# EAGLE design kalib103_v2b (EAGLE 6.4)
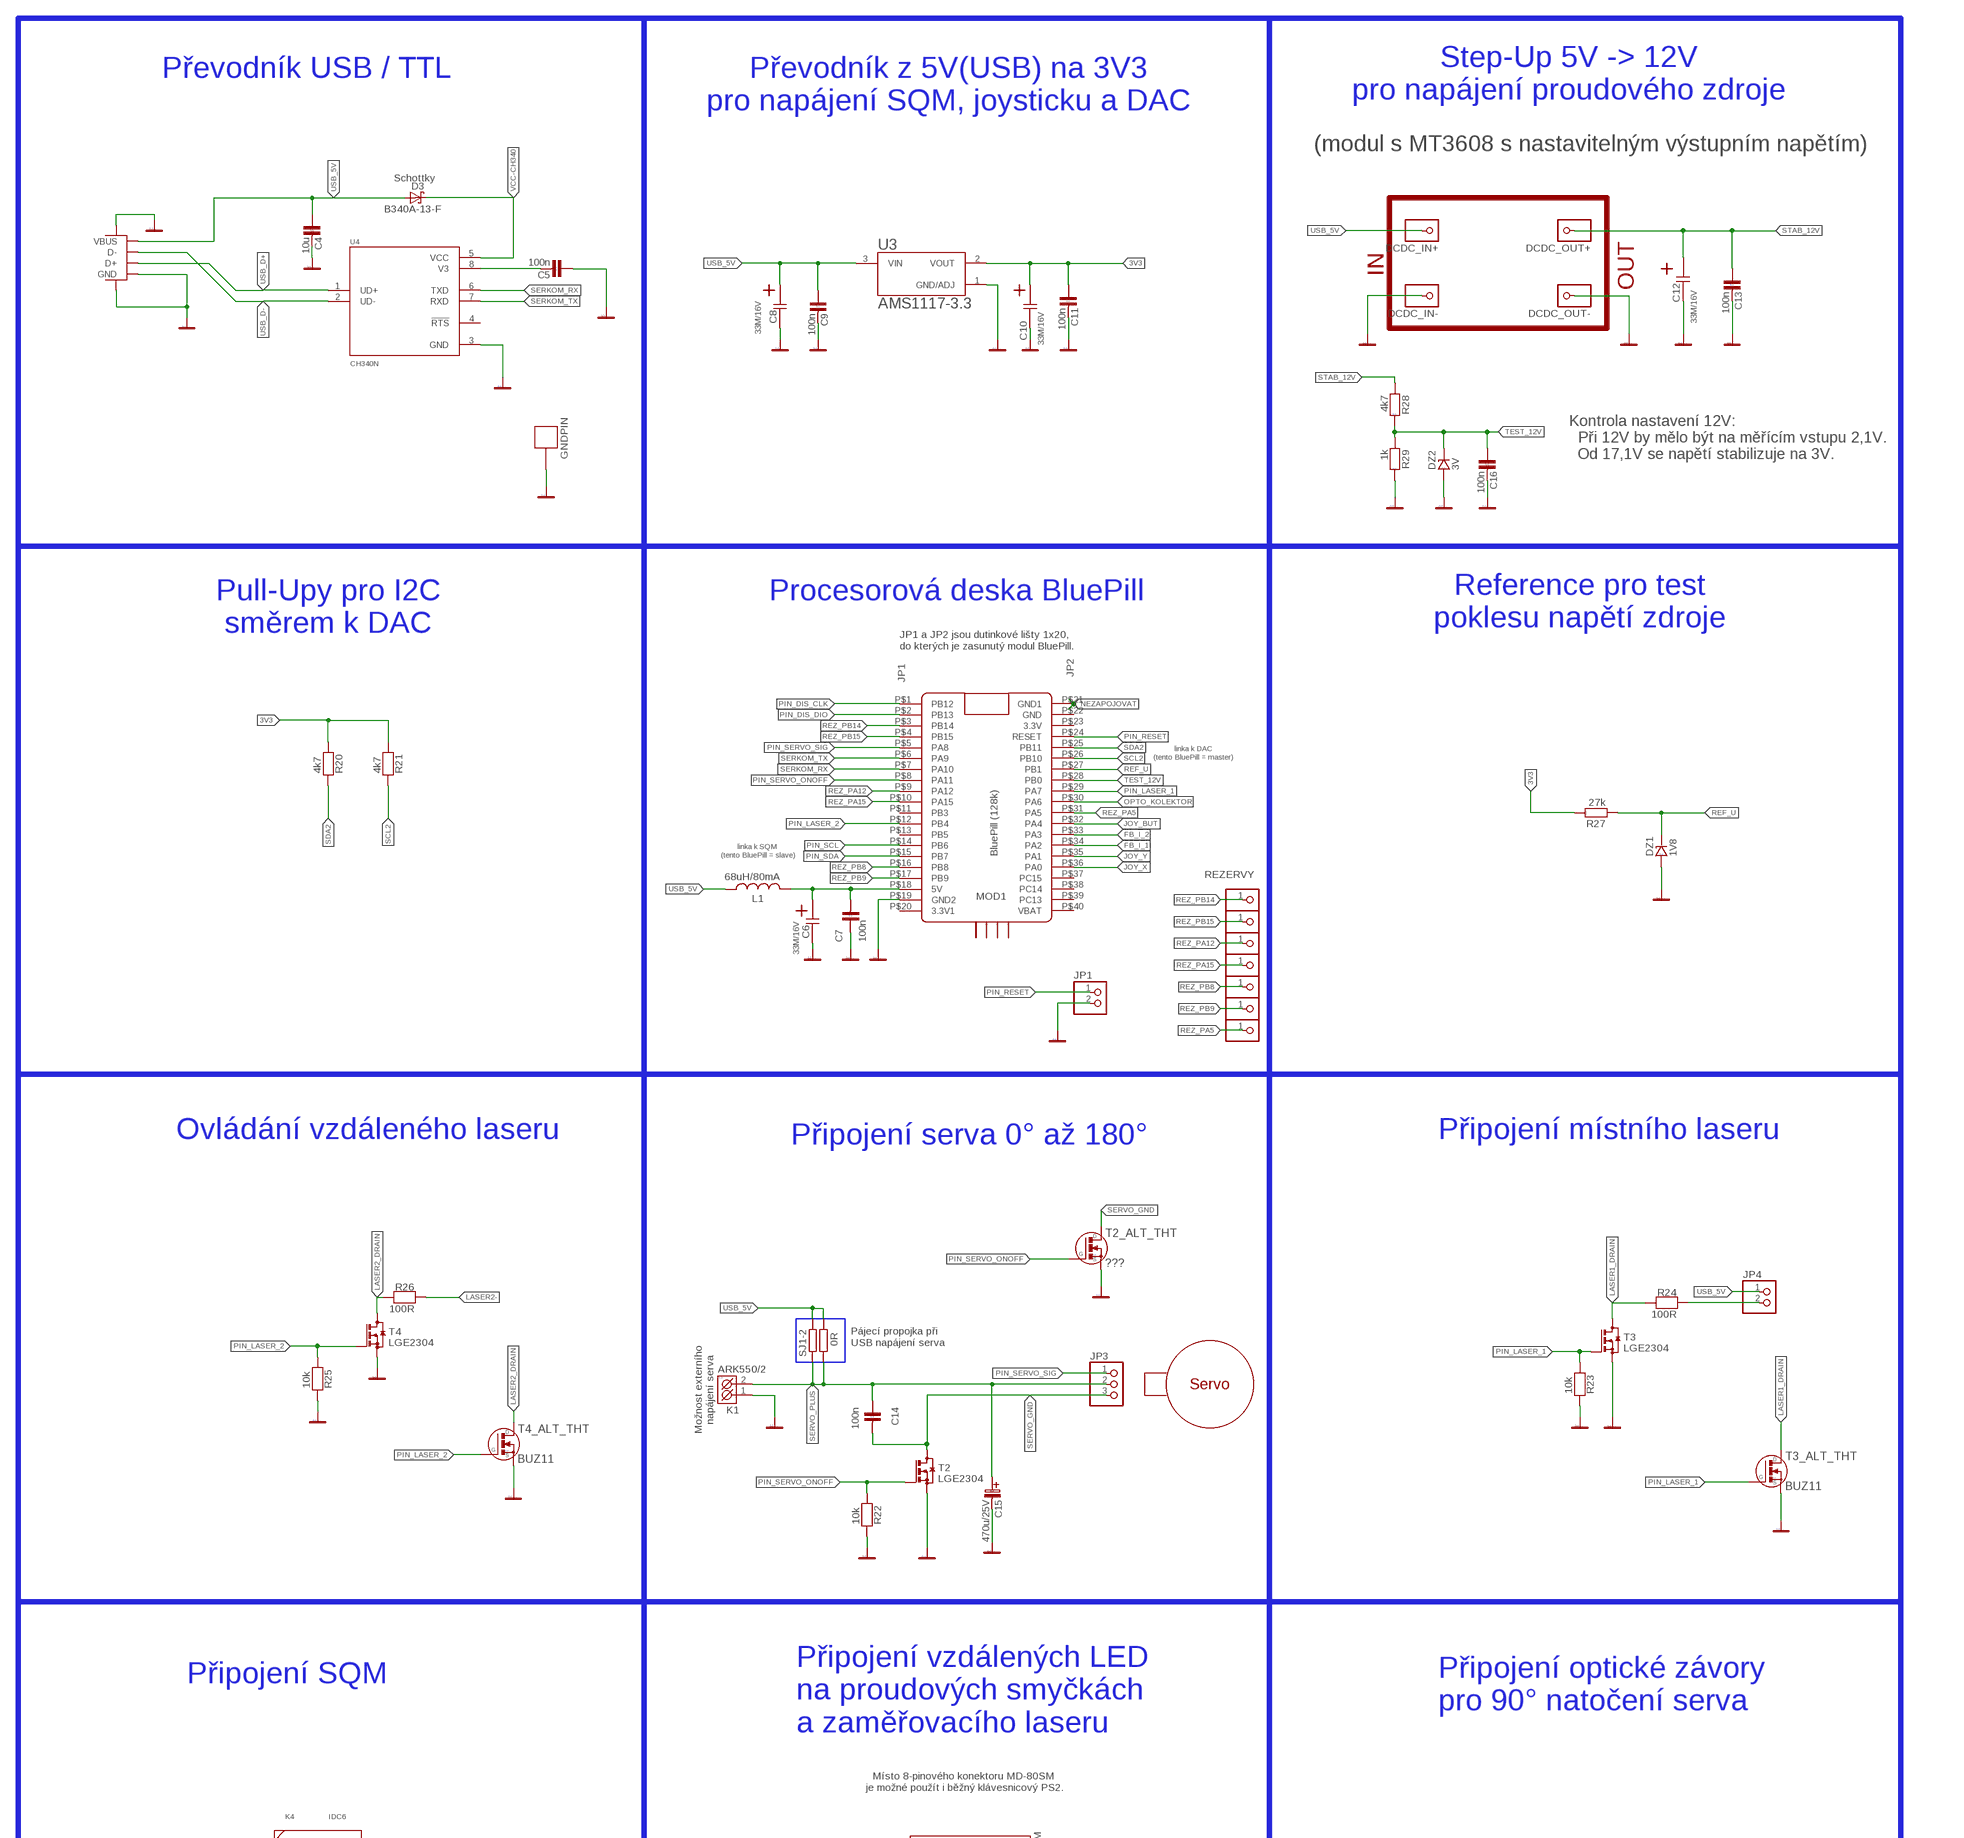
[diagram p0: schematic, sheet 1, part 1 of 2]
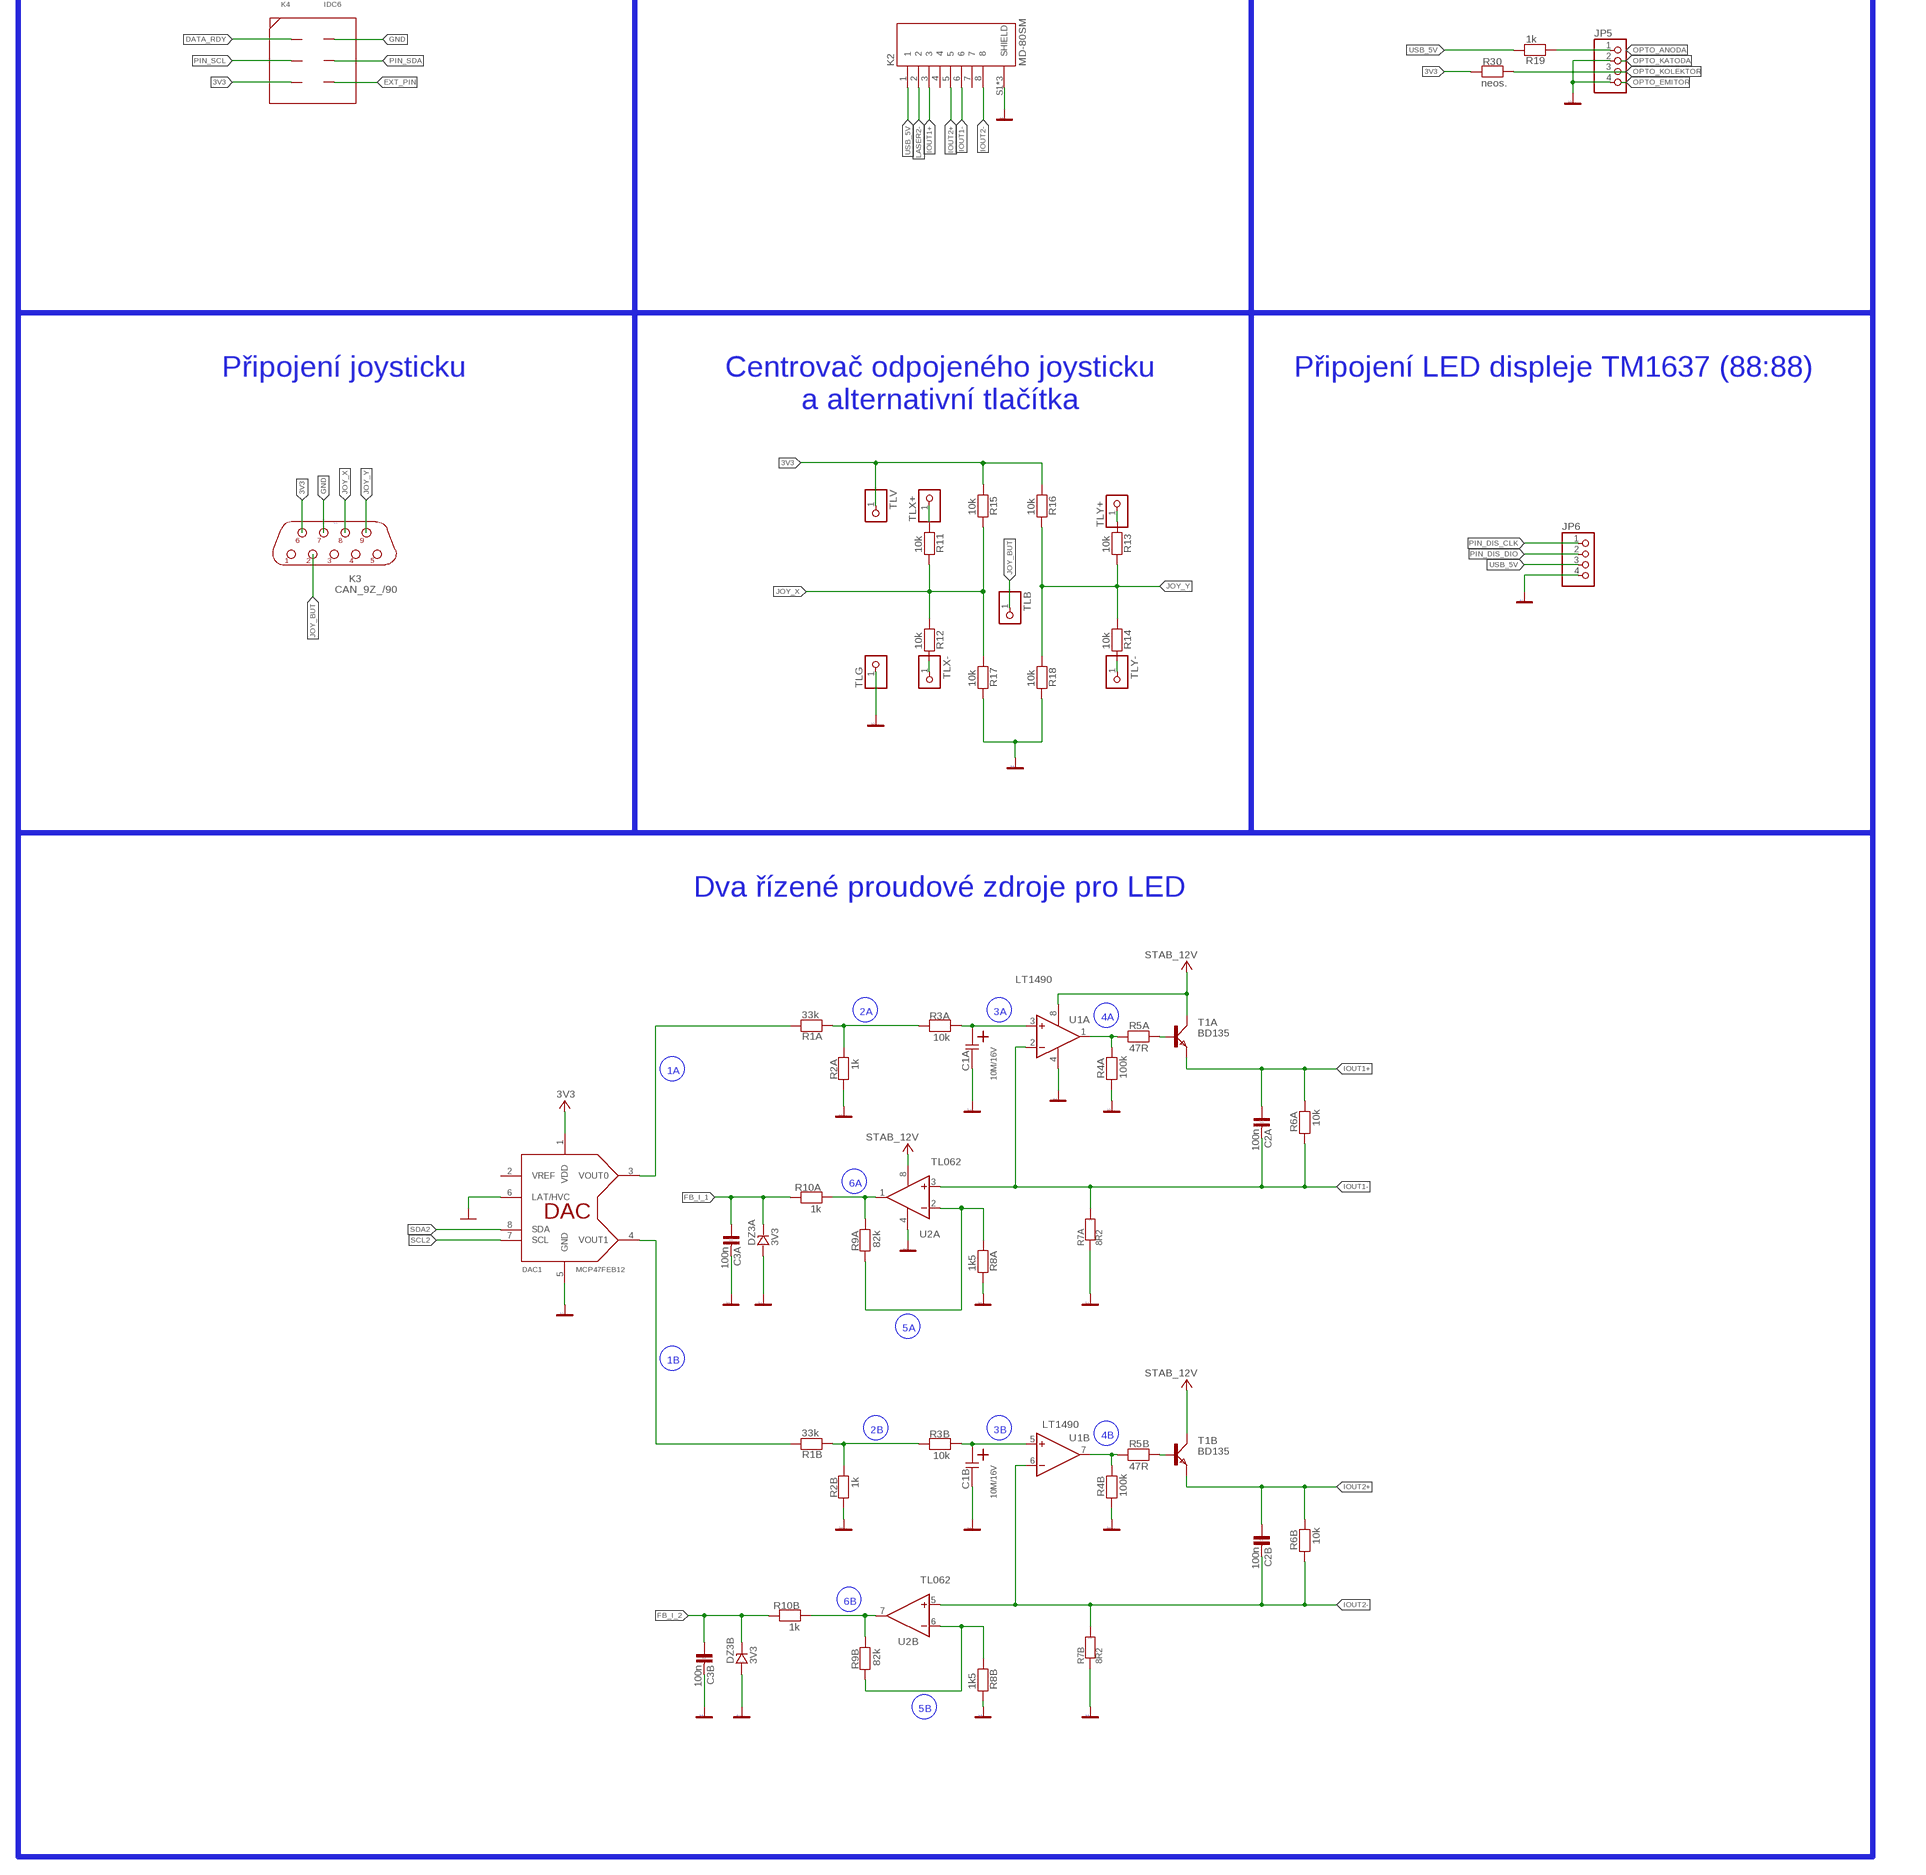
[diagram p1: schematic, sheet 1, part 2 of 2]

## Parts
C1A  10M/16V  C0805@2  [6032]
C1B  10M/16V  C0805@2  [6032]
C2A  100n  C-KERAMIK_SMD_0805  [0805]
C2B  100n  C-KERAMIK_SMD_0805  [0805]
C3A  100n  C-KERAMIK_SMD_0805  [0805]
C3B  100n  C-KERAMIK_SMD_0805  [0805]
C4  10u  C-KERAMIK_SMD_0805  [0805]
C5  100n  C-KERAMIK_SMD_0805  [0805]
C6  33M/16V  C0805@2  [6032]
C7  100n  C-KERAMIK_SMD_0805  [0805]
C8  33M/16V  C0805@2  [6032]
C9  100n  C-KERAMIK_SMD_0805  [0805]
C10  33M/16V  C0805@2  [6032]
C11  100n  C-KERAMIK_SMD_0805  [0805]
C12  33M/16V  C0805@2  [6032]
C13  100n  C-KERAMIK_SMD_0805  [0805]
C14  100n  C-KERAMIK_SMD_0805  [0805]
C15  470u/25V  C-EL_5  [C-EL_5]
C16  100n  C-KERAMIK_SMD_0805  [0805]
D3  B340A-13-F  SCHOTTKY-DIODESMD  [SMB]
DAC1  MCP47FEB12  MCP47FEB  [TSSOP-8]
DCDC_IN+  pin  PINHD-1X1-BIGPOGO  [1X1-BIGPOGO]
DCDC_IN-  pin  PINHD-1X1-BIGPOGO  [1X1-BIGPOGO]
DCDC_OUT+  pin  PINHD-1X1-BIGPOGO  [1X1-BIGPOGO]
DCDC_OUT-  pin  PINHD-1X1-BIGPOGO  [1X1-BIGPOGO]
DZ1  1V8  D-ZENEROVA_0,5W_BZV55C_SMD  [SOD-80]
DZ2  3V  D-ZENEROVA_0,5W_BZV55C_SMD  [SOD-80]
DZ3A  3V3  D-BZV55C_SMD_0,5W-ZENER  [SOD-80]
DZ3B  3V3  D-BZV55C_SMD_0,5W-ZENER  [SOD-80]
GNDPIN  BIGPIN  [BIGPIN]
JP1  PINHD-1X2  [1X02]
JP3  PINHD-1X3  [1X03]
JP4  PINHD-1X2  [1X02]
JP5  PINHD-1X4  [1X04]
JP6  PINHD-1X4  [1X04]
K1  ARK550/2  [ARK550/2]
K2  MD-80SM  [CUI_MD-80SM]
K3  CAN_9Z_/90  [CAN9Z/90]
K4  IDC6  [IDC6]
K5  USBPTH  [USB-B-PTH]
L1  68uH/80mA  L-USL0805  [L0805]
MOD1  BluePill (128k)  BLUE_PILL  [BLUE_PILL]
R1A  33k  R0805  [0805]
R1B  33k  R0805  [0805]
R2A  1k  R0805  [0805]
R2B  1k  R0805  [0805]
R3A  10k  R0805  [0805]
R3B  10k  R0805  [0805]
R4A  100k  R0805  [0805]
R4B  100k  R0805  [0805]
R5A  47R  R0805  [0805]
R5B  47R  R0805  [0805]
R6A  10k  R0805  [0805]
R6B  10k  R0805  [0805]
R7A  8R2  R_12,7  [R-12,7]
R7B  8R2  R_12,7  [R-12,7]
R8A  1k5  R0805  [0805]
R8B  1k5  R0805  [0805]
R9A  82k  R0805  [0805]
R9B  82k  R0805  [0805]
R10A  1k  R0805  [0805]
R10B  1k  R0805  [0805]
R11  10k  R0805  [0805]
R12  10k  R0805  [0805]
R13  10k  R0805  [0805]
R14  10k  R0805  [0805]
R15  10k  R0805  [0805]
R16  10k  R0805  [0805]
R17  10k  R0805  [0805]
R18  10k  R0805  [0805]
R19  1k  R0805  [0805]
R20  4k7  R0805  [0805]
R21  4k7  R0805  [0805]
R22  10k  R0805  [0805]
R23  10k  R0805  [0805]
R24  100R  R0805  [0805]
R25  10k  R0805  [0805]
R26  100R  R0805  [0805]
R27  27k  R_SMD_0805  [0805]
R28  4k7  R_SMD_0805  [0805]
R29  1k  R_SMD_0805  [0805]
R30  neos.  R0805  [0805]
REZERVA1  PINHD-1X1  [1X01]
REZERVA2  PINHD-1X1  [1X01]
REZERVA3  PINHD-1X1  [1X01]
REZERVA4  PINHD-1X1  [1X01]
REZERVA5  PINHD-1X1  [1X01]
REZERVA6  PINHD-1X1  [1X01]
REZERVA7  PINHD-1X1  [1X01]
SJ1-1  0R  R-EU_R0603  [R0603]
SJ1-2  0R  R-EU_R0603  [R0603]
T1A  BD135  BD139  [TO126AS]
T1B  BD135  BD139  [TO126AS]
T2  LGE2304  BSS123  [SOT23]
T2_ALT_THT  ???  BUZ11  [TO-220S]
T3  LGE2304  BSS123  [SOT23]
T3_ALT_THT  BUZ11  [TO-220S]
T4  LGE2304  BSS123  [SOT23]
T4_ALT_THT  BUZ11  [TO-220S]
TLB  PINHD-1X1  [1X01]
TLG  PINHD-1X1  [1X01]
TLV  PINHD-1X1  [1X01]
TLX+  PINHD-1X1  [1X01]
TLX-  PINHD-1X1  [1X01]
TLY+  PINHD-1X1  [1X01]
TLY-  PINHD-1X1  [1X01]
U1  LT1490  OP200P@2  [SOP-8]
U2  TL062  OP200P@2  [SOP-8]
U3  AMS1117-3.3  [SOT229P700X180-4N]
U4  CH340N  [SOIC127P600X160-8N]
U$1  SERVO_MG_996  [SERVO_MG_996]

## Nets
3V3: C10.1 C11.1 DAC1.1(VDD) K3.6 K4.P5(PIN5) R15.2 R16.2 R20.2 R21.2 R27.2 R30.2 TLV.1 U3.2(VOUT)
B_T1_A: R5A.2 T1A.B
B_T1_B: R5B.2 T1B.B
BOD_TLX+: R11.2 TLX+.1
BOD_TLX-: R12.1 TLX-.1
BOD_TLY+: R13.2 TLY+.1
BOD_TLY-: R14.1 TLY-.1
CH340-V3: C5.2 U4.8(V3)
DAC_OUT_0: DAC1.3(VOUT0) R1A.1
DAC_OUT_1: DAC1.4(VOUT1) R1B.1
DATA_RDY: K4.P1(PIN1)
EXT_PIN: K4.P6(PIN6)
FB_I_1: C3A.1 DZ3A.K MOD1.P$34(PA2) R10A.2
FB_I_2: C3B.1 DZ3B.K MOD1.P$33(PA3) R10B.2
GND: C1A.2 C1B.2 C3A.2 C3B.2 C4.2 C5.1 C6.2 C7.1 C8.2 C9.2 C10.2 C11.2 C12.2 C13.2 C15.C-(C_EL-) C16.2 DAC1.5(GND) DAC1.6(LAT/HVC) DCDC_IN-.P$1 DCDC_OUT-.P$1 DZ1.A DZ2.A DZ3A.A DZ3B.A GNDPIN.P$1 JP1.2 JP5.2 JP5.4 JP6.4 K1.1(K1) K2.S1(SHIELD) K2.S2(SHIELD) K2.S3(SHIELD) K3.7 K4.P2(PIN2) K5.GND K5.P$2(SHIELD) K5.SHIELD(SHIELD2) MOD1.P$19(GND2) R2A.2 R2B.2 R4A.2 R4B.2 R7A.1 R7B.1 R8A.1 R8B.1 R17.1 R18.1 R22.1 R23.1 R25.1 R29.2 T2.2(S) T2_ALT_THT.3(S) T3.2(S) T3_ALT_THT.3(S) T4.2(S) T4_ALT_THT.3(S) TLG.1 U1.4(P:V-) U2.4(P:V-) U3.1(GND/ADJ) U4.3(GND)
IN_DELIC_A: R1A.2 R2A.1 R3A.2
IN_DELIC_B: R1B.2 R2B.1 R3B.2
IOUT1+: C2A.1 K2.3 R6A.1 T1A.E
IOUT1-: C2A.2 K2.6 R6A.2 R7A.2 U1.2(A:-IN) U2.3(A:+IN)
IOUT2+: C2B.1 K2.5 R6B.1 T1B.E
IOUT2-: C2B.2 K2.8 R6B.2 R7B.2 U1.6(B:-IN) U2.5(B:+IN)
JOY_BUT: K3.2 MOD1.P$32(PA4) TLB.1
JOY_X: K3.8 MOD1.P$36(PA0) R11.1 R12.2 R15.1 R17.2
JOY_Y: K3.9 MOD1.P$35(PA1) R13.1 R14.2 R16.1 R18.2
LASER1-: JP4.2 R24.1
LASER1_DRAIN: R24.2 T3.3(D) T3_ALT_THT.2(D)
LASER2-: K2.2 R26.1
LASER2_DRAIN: R26.2 T4.3(D) T4_ALT_THT.2(D)
NEZAPOJOVAT: MOD1.P$21(GND1)
OPTO_ANODA: JP5.1 R19.2
OPTO_KOLEKTOR: JP5.3 MOD1.P$30(PA6) R30.1
OUT_I1_FB: R9A.1 R10A.1 U2.1(A:OUT)
OUT_I2_FB: R9B.1 R10B.1 U2.7(B:OUT)
OUT_U1A: R4A.1 R5A.1 U1.1(A:OUT)
OUT_U1B: R4B.1 R5B.1 U1.7(B:OUT)
PIN_DIS_CLK: JP6.1 MOD1.P$1(PB12)
PIN_DIS_DIO: JP6.2 MOD1.P$2(PB13)
PIN_LASER_1: MOD1.P$29(PA7) R23.2 T3.1(G) T3_ALT_THT.1(G)
PIN_LASER_2: MOD1.P$12(PB4) R25.2 T4.1(G) T4_ALT_THT.1(G)
PIN_RESET: JP1.1 MOD1.P$24(RESET)
PIN_SCL: K4.P3(PIN3) MOD1.P$14(PB6)
PIN_SDA: K4.P4(PIN4) MOD1.P$15(PB7)
PIN_SERVO_ONOFF: MOD1.P$8(PA11) R22.2 T2.1(G) T2_ALT_THT.1(G)
PIN_SERVO_SIG: JP3.1 MOD1.P$5(PA8)
REF_U: DZ1.K MOD1.P$27(PB1) R27.1
REZ_PA5: MOD1.P$31(PA5) REZERVA7.1
REZ_PA12: MOD1.P$9(PA12) REZERVA3.1
REZ_PA15: MOD1.P$10(PA15) REZERVA4.1
REZ_PB8: MOD1.P$16(PB8) REZERVA5.1
REZ_PB9: MOD1.P$17(PB9) REZERVA6.1
REZ_PB14: MOD1.P$3(PB14) REZERVA1.1
REZ_PB15: MOD1.P$4(PB15) REZERVA2.1
SCL2: DAC1.7(SCL) MOD1.P$26(PB10) R21.1
SDA2: DAC1.8(SDA) MOD1.P$25(PB11) R20.1
SERKOM_RX: MOD1.P$7(PA10) U4.6(TXD)
SERKOM_TX: MOD1.P$6(PA9) U4.7(RXD)
SERVO_GND: C14.2 JP3.3 T2.3(D) T2_ALT_THT.2(D)
SERVO_PLUS: C14.1 C15.C+(C_EL+) JP3.2 K1.2(K2) SJ1-1.1 SJ1-2.1
STAB_12V: C12.1 C13.1 DCDC_OUT+.P$1 R28.1 T1A.C T1B.C U1.8(P:V+) U2.8(P:V+)
TEST_12V: C16.1 DZ2.K MOD1.P$28(PB0) R28.2 R29.1
U1A_NEINVERT: C1A.1 R3A.1 U1.3(A:+IN)
U1B_NEINVERT: C1B.1 R3B.1 U1.5(B:+IN)
U2A_INVERT: R8A.2 R9A.2 U2.2(A:-IN)
U2B_INVERT: R8B.2 R9B.2 U2.6(B:-IN)
USB_5V: C4.1 C8.1 C9.1 D3.A DCDC_IN+.P$1 JP4.1 JP6.3 K2.1 K5.VBUS L1.1 R19.1 SJ1-1.2 SJ1-2.2 U3.3(VIN)
USB_5V_STM: C6.1 C7.2 L1.2 MOD1.P$18(5V)
USB_D+: K5.D+ U4.1(UD+)
USB_D-: K5.D- U4.2(UD-)
VCC-CH340: D3.C U4.5(VCC)
Unconnected: DAC1.2(VREF) K2.4 K2.7 K3.1 K3.3 K3.4 K3.5 MOD1.P$11(PB3) MOD1.P$13(PB5) MOD1.P$20(3.3V1) MOD1.P$22(GND) MOD1.P$23(3.3V) MOD1.P$37(PC15) MOD1.P$38(PC14) MOD1.P$39(PC13) MOD1.P$40(VBAT) U4.4(!RTS)

## Notes on the sheet
- Převodník USB / TTL
- Step-Up 5V -> 12V
  pro napájení proudového zdroje
- Převodník z 5V(USB) na 3V3
  pro napájení SQM, joysticku a DAC
- (modul s MT3608 s nastavitelným výstupním napětím)
- Schottky
- OUT
- IN
- Kontrola nastavení 12V: 
    Při 12V by mělo být na měřícím vstupu 2,1V.
    Od 17,1V se napětí stabilizuje na 3V.
- Procesorová deska BluePill
- Reference pro test
  poklesu napětí zdroje
- Pull-Upy pro I2C
  směrem k DAC
- JP1 a JP2 jsou dutinkové lišty 1x20,
  do kterých je zasunutý modul BluePill.
- JP2
- JP1
- linka k DAC
  (tento BluePill = master)
- linka k SQM 
  (tento BluePill = slave)
- REZERVY
- Ovládání vzdáleného laseru | Připojení serva 0° až 180° | Připojení místního laseru
- Pájecí propojka při
  USB napájení serva
- Možnost externího
  napájení serva
- Připojení SQM
- Připojení optické závory
  pro 90° natočení serva
- Připojení vzdálených LED
  na proudových smyčkách
  a zaměřovacího laseru
- Místo 8-pinového konektoru MD-80SM 
  je možné použít i běžný klávesnicový PS2.
- Připojení joysticku | Připojení LED displeje TM1637 (88:88)
- Centrovač odpojeného joysticku
  a alternativní tlačítka
- Dva řízené proudové zdroje pro LED
- 2A | 3A
- 4A
- 1A
- 6A
- 5A
- 1B
- 2B | 3B
- 4B
- 6B
- 5B

## Library data of the parts
C1A C1B C6 C8 C10 C12 = DISCRETE:C0805@2
C2A C2B C3A C3B C4 C5 C7 C9 C11 C13 C14 C16 = #PaJa_30:C-KERAMIK: Kondenzator - keramicky
C15 = #PaJa_31:C-EL: Kondenzator - elektrolyticky
D3 = diode:SCHOTTKY-DIODE: Schottky Diode
DAC1 = mcp47FEB:MCP47FEB: MCP47FEB Dvoukanalovy D/A prevodnik s komunikaci I2C
DCDC_IN+ DCDC_IN- DCDC_OUT+ DCDC_OUT- = adafruit:PINHD-1X1: Pin header 1x1 for 0.1" spacing With round pins
DZ1 DZ2 = #PaJa_30:D-ZENEROVA: Zenerova dioda
DZ3A DZ3B = #PaJa_31:D-?-ZENER: Zenerova dioda
GNDPIN = bigpin:BIGPIN: Jeden ovalny pin
JP1 JP4 = pinhead:PINHD-1X2: PIN HEADER
JP3 = pinhead:PINHD-1X3: PIN HEADER
JP5 JP6 = pinhead:PINHD-1X4: PIN HEADER
K1 = #PaJa_konektory:ARK550/2: Svorkovnice - roztec 3,5mm - dvojita
K2 = MD-80SM:MD-80SM: Check availability <https://pricing.snapeda.com/parts/MD-80SM/Same%20Sky/view-part?ref=eda>; AVAILABILITY: In Stock; CHECK_PRICES: https://www.snapeda.com/parts/MD-80SM/Same+Sky/view-part/?ref=eda; DESCRIPTION: 8 Pin, Mini Circular Connector w/ Shield; MF: Same Sky; MP: MD-80SM; PACKAGE: None; PRICE: None; SNAPEDA_LINK: https://www.snapeda.com/parts/MD-80SM/Same+Sky/view-part/?ref=snap
K3 = #PaJa_konektory-original:CAN_9Z: Konektory CANNON - zasuvka - 9pinu
K4 = idc6:IDC6
K5 = USB-B:USB: USB Connectors USB-B-PTH is fully proven SKU : PRT-00139 USB-miniB is fully proven SKU : PRT-00587 USB-A-PCB is untested. USB-A-H is C@H proven USB-B-SMT is throughly reviewed, but untested. Needs silkscreen touching up. USB-A-S has not been used/tested USB-MB-H has not been used/tested
L1 = rcl:L-US: INDUCTOR, American symbol
MOD1 = BluePill:BLUE_PILL
R1A R1B R2A R2B R3A R3B R4A R4B R5A R5B R6A R6B R8A R8B R9A R9B R10A R10B R11-R26 R30 = DISCRETE:R0805
R7A R7B = #PaJa_31:R: Rezistor
R27-R29 = #PaJa_30:R: Rezistor
REZERVA1-REZERVA7 TLB TLG TLV TLX+ TLX- TLY+ TLY- = pinhead:PINHD-1X1: PIN HEADER
SJ1-1 SJ1-2 = rcl:R-EU_: RESISTOR, European symbol
T1A T1B = TRANS-PW:BD139
T2-T4 = transistor-small-signal:BSS123: N-CHANNEL MOS FET
T2_ALT_THT T3_ALT_THT T4_ALT_THT = #PaJa_31:BUZ11: N-Channel Enhancement MOSFET 50V; 20A; 0,080Ohm
U1 U2 = LINEAR:OP200P@2
U3 = AMS1117-3.3:AMS1117-3.3: Check availability <https://pricing.snapeda.com/parts/AMS1117-3.3/Advanced%20Monolithic%20Systems/view-part?ref=eda>; AVAILABILITY: Not in stock; CHECK_PRICES: https://www.snapeda.com/parts/AMS1117-3.3/Advanced+Monolithic+Systems/view-part/?ref=eda; DESCRIPTION: Sot223/Pkg 1-Amp 3.3-Volt Low Drop Out Voltage Regulatator; MF: Advanced Monolithic Systems; MP: AMS1117-3.3; PACKAGE: SOT-223 Seeed Technology; PRICE: None; SNAPEDA_LINK: https://www.snapeda.com/parts/AMS1117-3.3/Advanced+Monolithic+Systems/view-part/?ref=snap
U4 = CH340N:CH340N: Check availability <https://pricing.snapeda.com/parts/CH340N/WCH/view-part?ref=eda>; AVAILABILITY: Not in stock; CHECK_PRICES: https://www.snapeda.com/parts/CH340N/WCH/view-part/?ref=eda; DESCRIPTION: USB to Serial Port Chip; MF: WCH; MP: CH340N; PACKAGE: Package; PRICE: None; SNAPEDA_LINK: https://www.snapeda.com/parts/CH340N/WCH/view-part/?ref=snap
U$1 = servo_mecha:SERVO_MG_996

## Board
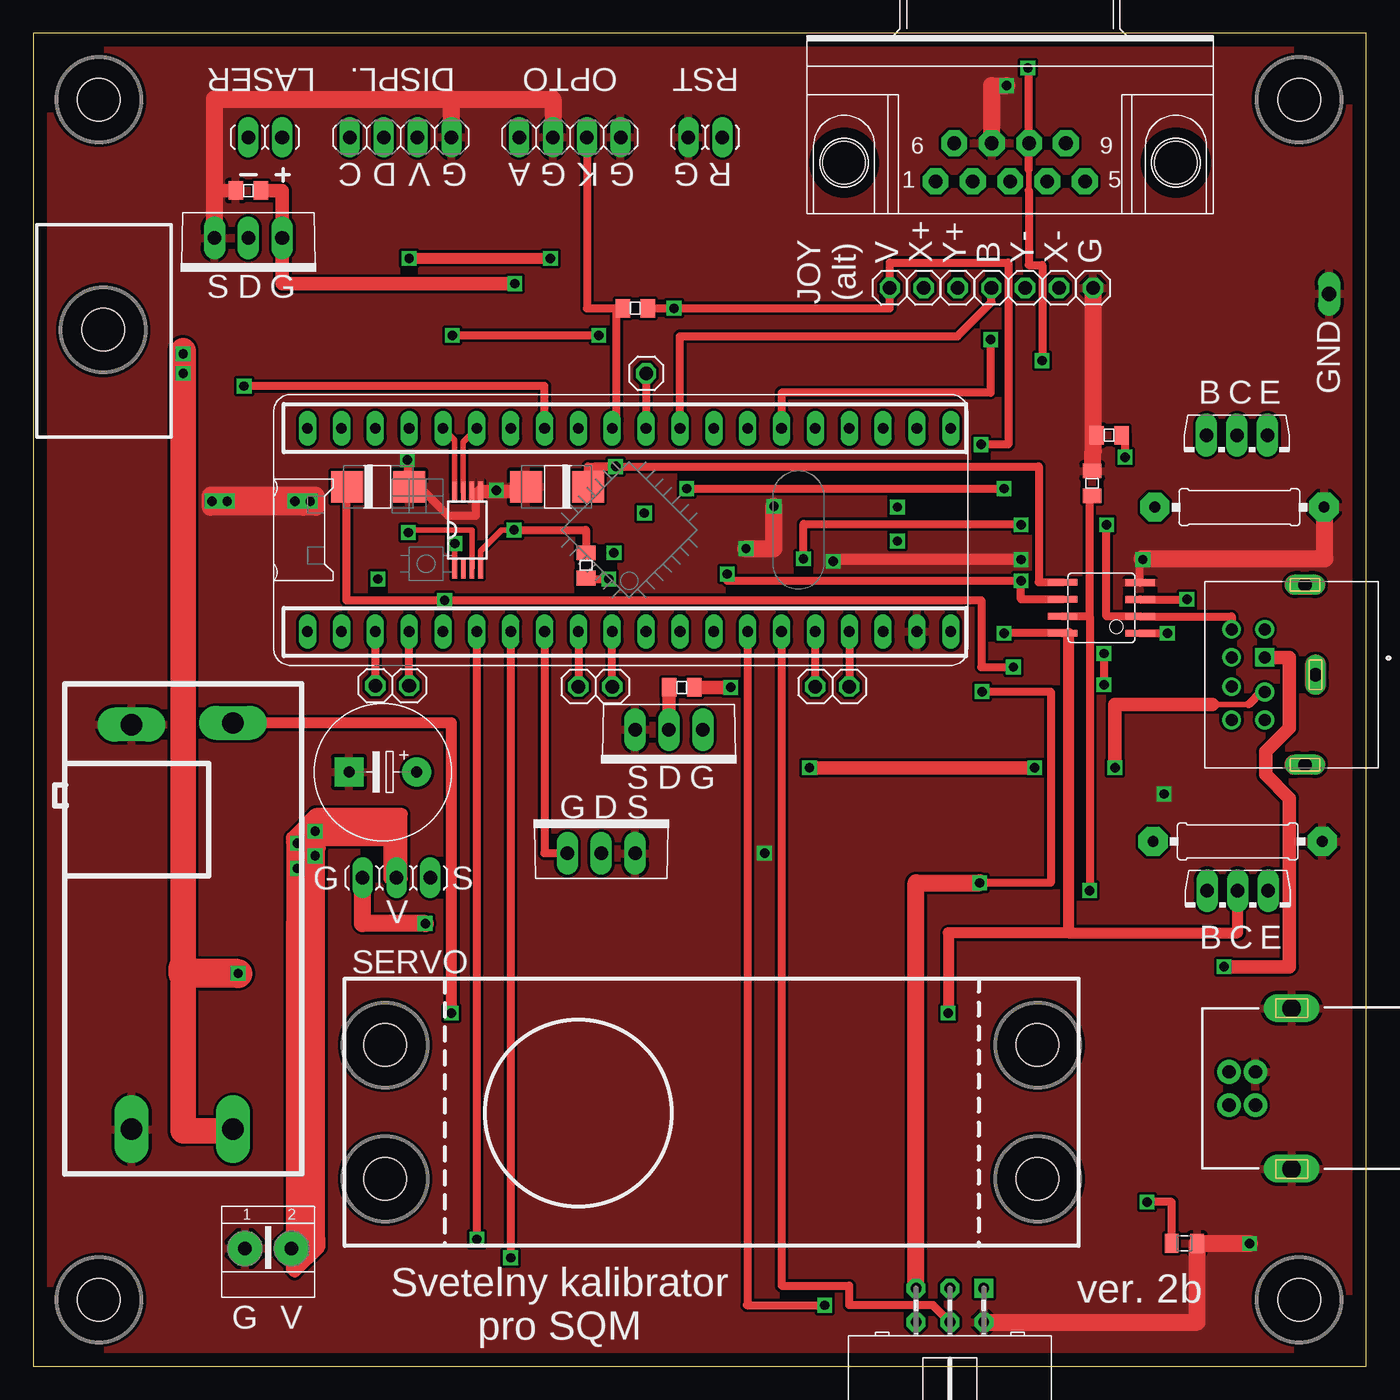
[diagram p2: board, top side]
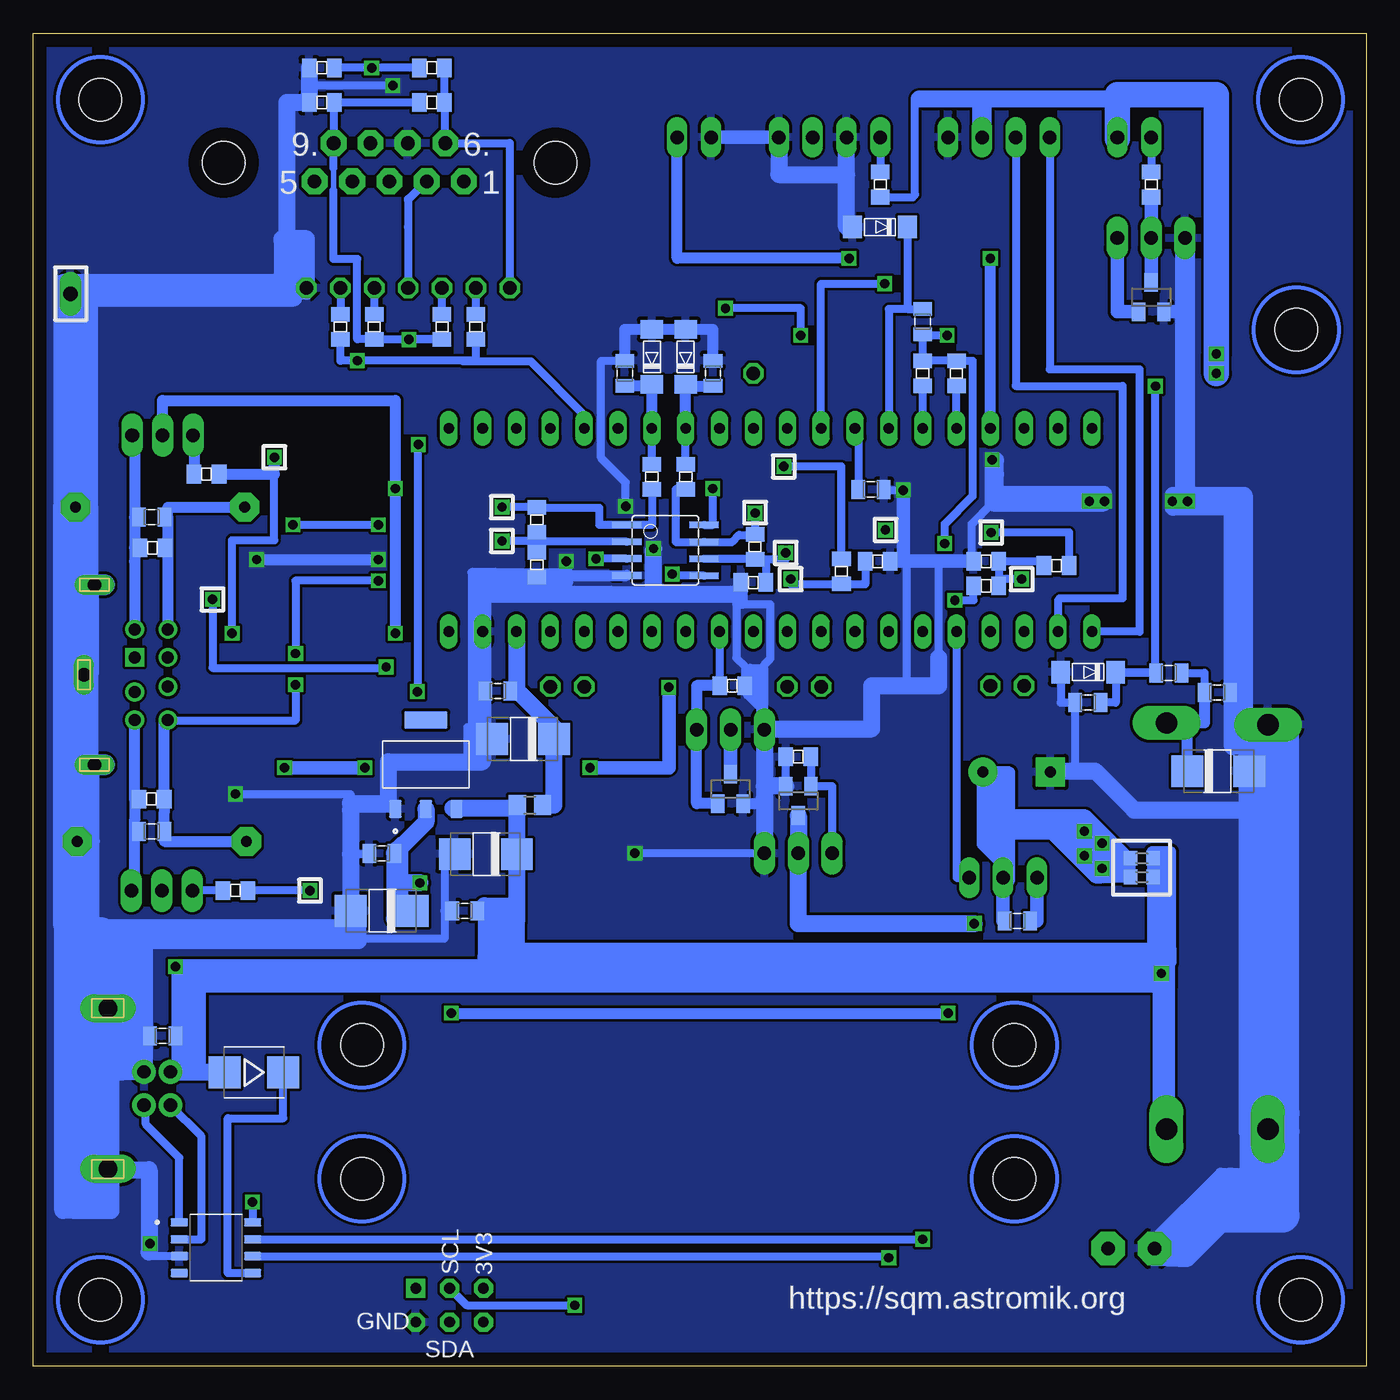
[diagram p3: board, bottom side, seen from below]

Size 100 x 100 mm. Coordinates in mm from the lower left corner, seen from the top.
Outline: 0,0 100,0 100,100 0,100 0,0
Copper layers (1*16): Top 0.035mm / dielectric 1.5mm / Bottom 0.035mm
Design rules "default *": minimum track width 10mil, minimum drill 24mil, track to track 8mil, track to pad 8mil, pad to pad 8mil, via to via 8mil, smd to smd 8mil, copper to edge 40mil, drill to drill 8mil, minimum pad ring 10mil, minimum via ring 8mil, stop-mask expansion 4mil, vias tented up to drill 0mil, thermal gap 10mil
Holes 3.2 mm at 4.92,4.98 94.96,4.98 4.92,95.02 94.96,95.02 5.24,77.75

### Footprints (pad centres in the part's own frame; a part is rotated, then mirrored left to right if it is on the bottom)
6032 = smd 2.388 x 2.388: 1 -2.311,0; 2 2.337,0
0805 = smd 1.016 x 1.422: 1 -0.953,0; 2 0.953,0
C-EL_5 = drill 0.813 pad 2.184: C+ -2.54,0 | drill 0.813 pad 2.184 square: C- 2.54,0
SMB = smd 2.4 x 2.4: A 2.2,0; C -2.2,0
TSSOP-8 = smd 1.524 x 0.35: 1 -2.875,0.975; 2 -2.875,0.325; 3 -2.875,-0.325; 4 -2.875,-0.975; 5 2.875,-0.975; 6 2.875,-0.325; 7 2.875,0.325; 8 2.875,0.975
1X1-BIGPOGO = drill 1.6 pad 2.54 long: P$1 0,0
SOD-80 = smd 1.397 x 1.702: A 1.905,0; K -2.223,0
BIGPIN = drill 1.1 long: P$1 0,0
1X02 = drill 1.016 pad 1.422 long: 1 -1.27,0; 2 1.27,0
1X03 = drill 1.016 long: 1 -2.54,0; 2 0,0; 3 2.54,0
1X04 = drill 1.016 long: 1 -3.81,0; 2 -1.27,0; 3 1.27,0; 4 3.81,0
ARK550/2 = drill 1.016 pad 2.54 octagon: 1 0,0; 2 3.493,0
CUI_MD-80SM = drill 0.9 square: 1 1.3,3.8 | drill 0.9: 2 -1.3,3.8; 3 3.4,3.8; 4 1.3,6.3; 5 -3.4,3.8; 6 3.4,6.3; 7 -0.9,6.3; 8 -3.4,6.3 | drill 1 pad 1.23 long: S1 0,0; S2 -6.75,0.8; S3 6.75,0.8
CAN9Z/90 = drill 1.016 pad 1.93 octagon: 1 -5.588,-0.127; 2 -2.794,-0.127; 3 0,-0.127; 4 2.794,-0.127; 5 5.62,-0.127; 6 -4.191,2.731; 7 -1.365,2.731; 8 1.429,2.731; 9 4.191,2.731 | hole 3.2: 12.446,1.27; -12.446,1.27
IDC6 = drill 0.8 pad 1.422 square: P1 -2.54,-2.54 | drill 0.8 pad 1.422 octagon: P2 -2.54,0; P3 0,-2.54; P4 0,0; P5 2.54,-2.54; P6 2.54,0
USB-B-PTH = drill 1 pad 1.778: D+ 0,1.25; D- 1.981,1.25; GND 0,-1.25; VBUS 1.981,-1.25 | drill 1.4 long: P$2 -2.718,6.02; SHIELD -2.718,-6.02
L0805 = smd 1.3 x 1.5: 1 -0.95,0; 2 0.95,0
BLUE_PILL = drill 0.8 long: P$1 -7.62,15.24; P$2 -7.62,12.7; P$3 -7.62,10.16; P$4 -7.62,7.62; P$5 -7.62,5.08; P$6 -7.62,2.54; P$7 -7.62,0; P$8 -7.62,-2.54; P$9 -7.62,-5.08; P$10 -7.62,-7.62; P$11 -7.62,-10.16; P$12 -7.62,-12.7; P$13 -7.62,-15.24; P$14 -7.62,-17.78; P$15 -7.62,-20.32; P$16 -7.62,-22.86; P$17 -7.62,-25.4; P$18 -7.62,-27.94; P$19 -7.62,-30.48; P$20 -7.62,-33.02; P$21 7.62,15.24; P$22 7.62,12.7; P$23 7.62,10.16; P$24 7.62,7.62; P$25 7.62,5.08; P$26 7.62,2.54; P$27 7.62,0; P$28 7.62,-2.54; P$29 7.62,-5.08; P$30 7.62,-7.62; P$31 7.62,-10.16; P$32 7.62,-12.7; P$33 7.62,-15.24; P$34 7.62,-17.78; P$35 7.62,-20.32; P$36 7.62,-22.86; P$37 7.62,-25.4; P$38 7.62,-27.94; P$39 7.62,-30.48; P$40 7.62,-33.02
0805' = smd 1.092 x 1.397: 1 -0.94,0; 2 0.94,0
R-12,7 = drill 0.813 pad 2.184 octagon: 1 -6.35,0; 2 6.35,0
1X01 = drill 1.016 octagon: 1 0,0
R0603 = smd 1 x 1.1: 1 -0.85,0; 2 0.85,0
TO126AS = drill 1.016 pad 1.626 long: B 2.286,-1.27; C 0,-1.27; E -2.286,-1.27
SOT23 = smd 1 x 1.4: 1 -0.95,-1.1; 2 0.95,-1.1; 3 0,1.1
TO-220S = drill 1.016 pad 1.6 long: 1 -2.54,0; 2 0,0; 3 2.54,0
SOP-8 = smd 0.5 x 2.2: 1 -1.905,-2.9; 2 -0.645,-2.9; 3 0.625,-2.9; 4 1.895,-2.9; 5 1.905,2.9; 6 0.635,2.9; 7 -0.635,2.9; 8 -1.905,2.9
SOT229P700X180-4N = smd 1.31 x 0.93: 1 -3.345,2.29; 2 -3.345,0; 3 -3.345,-2.29 | smd 1.31 x 3.24: 4 3.345,0
SOIC127P600X160-8N = smd 1.31 x 0.62: 1 -2.75,1.905; 2 -2.75,0.635; 3 -2.75,-0.635; 4 -2.75,-1.905; 5 2.75,-1.905; 6 2.75,-0.635; 7 2.75,0.635; 8 2.75,1.905
SERVO_MG_996 = hole 3.2: -4.859,14.379; 5.174,14.379; -4.859,-34.579; 5.174,-34.579

### Placement (x,y rotation side)
C1A  25.84,65.98 0 top
C1B  39.31,65.98 180 top
C2A  91.12,63.69 0 bottom
C2B  91.12,40.13 0 bottom
C3A  55.63,74.49 90 bottom
C3B  49.02,74.49 90 bottom
C4  90.3,24.77 180 bottom
C5  86.36,9.21 180 top
C6  63.25,47.05 180 bottom
C7  65.15,50.67 0 bottom
C8  66.04,38.42 180 bottom
C9  67.63,34.16 180 bottom
C10  73.85,34.16 180 bottom
C11  73.85,38.48 180 bottom
C12  11.11,44.64 0 bottom
C13  11.18,50.55 0 bottom
C14  26.16,33.4 0 bottom
C15  26.23,44.58 180 top
C16  37.15,65.79 0 bottom
D3  83.44,22.03 180 bottom
DAC1  32.58,62.74 90 top
DCDC_IN+  14.99,17.78 90 top
DCDC_IN-  7.37,17.78 90 top
DCDC_OUT+  14.99,48.26 0 top
DCDC_OUT-  7.37,48.13 180 top
DZ1  36.64,85.47 180 bottom
DZ2  21.02,52.07 180 bottom
DZ3A  53.59,75.88 90 bottom
DZ3B  51.05,75.88 90 bottom
GNDPIN  97.22,80.45 270 top
JP1  50.42,92.2 180 top
JP3  27.24,36.64 180 top
JP4  17.4,92.2 180 top
JP5  40.26,92.2 0 top
JP6  27.56,92.2 0 top
K1  15.88,8.83 0 top
K2  96.2,51.88 90 top
K3  73.28,89.03 0 top
K4  68.77,3.3 180 top
K5  91.69,20.83 180 top
L1  62.74,42.1 0 bottom
MOD1  35.81,62.74 90 top
R1A  33k  [0805']  23.24,60.07 180 bottom
R1B  33k  [0805']  41.47,60.07 270 top
R2A  1k  [0805']  28.51,60.39 180 bottom
R2B  1k  [0805']  36.64,60.39 0 bottom
R3A  10k  [0805']  28.51,58.55 0 bottom
R3B  10k  [0805']  39.37,59.63 270 bottom
R4A  100k  [0805']  80.71,69.85 180 top
R4B  100k  [0805']  79.44,66.23 90 top
R5A  47R  [0805']  87,66.93 180 bottom
R5B  47R  [0805']  84.84,35.69 180 bottom
R6A  10k  [0805']  91.06,61.4 0 bottom
R6B  10k  [0805']  91.12,42.55 0 bottom
R7A  90.49,64.45 180 top
R7B  90.36,39.37 180 top
R8A  1k5  [0805']  62.23,60.13 90 bottom
R8B  1k5  [0805']  45.97,58.8 0 bottom
R9A  82k  [0805']  62.23,63.5 270 bottom
R9B  82k  [0805']  45.85,61.47 270 bottom
R10A  1k  [0805']  53.59,66.74 90 bottom
R10B  1k  [0805']  51.05,66.74 90 bottom
R11  10k  [0805']  66.8,77.98 90 bottom
R12  10k  [0805']  76.96,77.98 270 bottom
R13  10k  [0805']  69.34,77.98 90 bottom
R14  10k  [0805']  74.42,77.98 270 bottom
R15  10k  [0805']  70.1,97.41 0 bottom
R16  10k  [0805']  70.1,94.81 0 bottom
R17  10k  [0805']  78.36,97.41 0 bottom
R18  10k  [0805']  78.36,94.81 0 bottom
R19  1k  [0805']  36.45,88.65 90 bottom
R20  4k7  [0805']  30.73,74.49 90 bottom
R21  4k7  [0805']  33.27,74.49 90 bottom
R22  10k  [0805']  42.61,45.72 0 bottom
R23  10k  [0805']  16.13,88.2 0 top
R24  100R  [0805']  16.13,88.65 270 bottom
R25  10k  [0805']  47.56,51.05 180 bottom
R26  100R  [0805']  48.64,50.93 180 top
R27  33.27,78.36 270 bottom
R28  14.8,52.01 180 bottom
R29  20.89,49.78 180 bottom
R30  neos.  [0805']  45.15,79.38 0 top
REZERVA1  25.65,51.05 0 top
REZERVA2  28.19,51.05 0 top
REZERVA3  40.89,50.99 0 top
REZERVA4  43.43,50.99 0 top
REZERVA5  58.67,50.99 0 top
REZERVA6  61.21,50.99 0 top
REZERVA7  45.97,74.49 0 top
SJ1-1  16.83,36.7 0 bottom
SJ1-2  16.83,38.1 0 bottom
T1A  90.3,68.58 180 top
T1B  90.36,34.42 180 top
T2  42.61,42.42 180 bottom
T2_ALT_THT  42.61,38.48 0 top
T3  16.13,80.2 0 bottom
T3_ALT_THT  16.13,84.65 180 top
T4  47.69,43.31 0 bottom
T4_ALT_THT  47.69,47.75 180 top
TLB  71.88,80.9 270 top
TLG  79.5,80.9 270 top
TLV  64.26,80.9 270 top
TLX+  66.8,80.9 270 top
TLX-  76.96,80.9 270 top
TLY+  69.34,80.9 270 top
TLY-  74.42,80.9 270 top
U1  80.14,56.9 90 top
U2  52.58,61.21 270 bottom
U3  70.55,45.15 90 bottom
U4  86.3,8.89 0 bottom
U$1  40.77,18.92 90 top

### Tracks (layer width: path | path; a pad name or v marks a point on that pad's centre or on a via)
3V3  (via drill 0.7)
  Top 0.406: DAC1.1 31.6,61.59
  Top 0.61: v31.43,77.34 v42.42,77.34 | v71.12,69.15 73.15,69.15 73.15,82.8 64.26,82.8 TLV.1 64.26,79.38 v48.07,79.38 R30.2 | v71.18,50.61 76.33,50.61 76.33,36.26 v70.99,36.26 | 31.6,61.59 31.6,61.7 v31.62,61.72
  Top 1.27: K4.P5 66.23,36.26 v70.99,36.26
  Bottom 0.61: 72.52,34.1 72.45,34.16 C10.1 | R15.2 R16.2 | R16.2 69.09,94.81 K3.6 64.26,91.76 TLV.1 | 69.15,94.98 R16.2 | R16.2 69.15,94.74 69.22,94.68 69.22,94.42 | v31.62,61.72 31.62,63.18 29.53,65.28 29.53,75.42 R20.2 R21.2 R27.2 33.27,77.34 v31.43,77.34 | v42.42,77.34 42.42,79.38 v48.07,79.38 | v71.12,69.15 71.18,69.15 v71.18,50.61 | 72.9,39.05 C11.1 72.33,39.05 72.33,39.12
  Bottom 1.27: 72.52,38.86 72.52,36.26 | 72.52,36.26 72.52,34.1 | v70.99,36.26 72.52,36.26 | C11.1 72.9,33.59 72.01,33.59 | U3.2 70.55,40.83 72.52,38.86 | 72.52,38.86 72.52,38.92 72.33,39.12
B_T1_A
  Bottom 0.813: T1A.B 87.94,69.85 R5A.2
B_T1_B
  Bottom 0.61: R5B.2 T1B.B
BOD_TLX+
  Bottom 0.61: TLX+.1 R11.2
BOD_TLX-
  Bottom 0.61: TLX-.1 R12.1
BOD_TLY+
  Bottom 0.61: R13.2 TLY+.1
BOD_TLY-
  Bottom 0.61: TLY-.1 R14.1
CH340-V3  (via drill 0.7)
  Top 0.61: C5.2 85.41,12.32 v83.57,12.32
  Bottom 0.61: v83.57,12.32 83.55,12.32 U4.8
DAC_OUT_0  (via drill 0.7)
  Top 0.406: DAC1.3 32.9,62.74 28.13,62.74 v28.13,62.55
  Bottom 0.61: R1A.1 22.3,62.55 v28.13,62.55
DAC_OUT_1  (via drill 0.7)
  Top 0.406: DAC1.4 33.55,61.17 35.12,62.74 v36.07,62.74
  Top 0.61: R1B.1 41.47,62.61 41.47,62.74 v36.07,62.74
FB_I_1
  Bottom 0.61: R10A.2 MOD1.P$34
  Bottom 0.813: MOD1.P$34 53.59,73.53 | 53.59,73.53 C3A.1 | 53.59,73.53 DZ3A.K
FB_I_2
  Bottom 0.61: R10B.2 MOD1.P$33 | C3B.1 49.09,73.53 49.09,73.55
  Bottom 0.813: MOD1.P$33 51.05,73.53 | 51.05,73.53 C3B.1 | 51.05,73.53 DZ3B.K
GND  (via drill 0.7)
  Top 0.406: DAC1.6 DAC1.5 33.21,65.61
  Top 0.61: 33.21,65.61 33.21,63.82 31.11,63.82 28.96,65.98 C1A.2 28.07,65.98 v28.07,68.01 | C1B.2 36.97,65.61 | v14.54,64.9 v19.62,64.9 | v34.73,65.72 34.73,65.6 | 60.01,60.52 v60.01,60.39 | U1.4 83.04,60.58 84.2,60.58
  Top 0.813: 79.5,68.64 79.77,68.64 R4A.2 | 79.5,67.23 R4B.2 | v74.11,60.52 60.01,60.52
  Top 1.016: 36.97,65.61 DAC1.5 | R23.1 13.59,88.2 T3_ALT_THT.3 | R7A.1 96.9,64.45
  Top 1.27: JP6.4 31.37,95.06 | 31.37,95.06 38.99,95.06 JP5.2 | v91.25,9.21 C5.1 87.31,3.3 K4.P2 | K3.7 71.91,96.08 v73.03,96.08 | T3_ALT_THT.3 13.59,95.06 31.37,95.06 | v53.47,61.34 55.56,61.34 v55.56,64.52 | 20.19,65.22 13.34,65.22 13.34,64.9 20.26,64.9 20.26,64.45 | 20.26,64.45 13.27,64.45 13.27,65.28 | 13.27,65.28 20.38,65.28 v20.77,64.9 | 13.34,65.34 21.21,65.34 21.21,64.45 20.26,64.45 | 13.27,65.28 13.27,65.34 | 79.5,67.23 79.5,68.64 TLG.1 | 83.19,60.58 84.2,60.58 96.9,60.58 96.9,64.45
  Bottom 0.305: 97.85,64.64 97.66,64.64 | T3_ALT_THT.3 13.46,84.64 | v28.07,68.01 27.81,68.01 27.81,66.93 | 9.14,48.45 10.22,48.45 10.22,48.32 | 47.24,57.9 47.31,57.9 47.31,57.85
  Bottom 0.61: C4.2 91.69,24.77 | 91.69,24.77 K5.GND 94.41,22.08 K5.P$2 | 94.41,14.8 K5.P$2 | C11.2 74.87,38.42 76.19,38.42 76.2,38.42 | 69.15,34.16 69.15,38.42 C8.2 | 69.15,34.16 C9.2 | 8.78,48.13 8.95,48.13 10.22,48.13 10.22,48.32 C13.2 10.16,50.55 10.16,64.9 v13.4,64.9 v14.54,64.9 | 8.78,48.13 C12.2 8.78,17.78 8.13,17.78 DCDC_IN-.P$1 | 8.78,48.13 DCDC_OUT-.P$1 | 95.4,51.88 K2.S3 95.4,64.45 R7A.1 | 95.4,51.88 K2.S2 95.31,45.13 95.31,39.37 | 95.4,51.88 K2.S1 | 91.69,24.77 91.69,32.89 | 95.31,33.21 95.31,39.37 | R7B.1 95.31,39.37 | v73.03,96.08 79.3,96.08 | U4.3 91.25,8.26 v91.25,9.21 91.25,14.81 K5.P$2 | 13.59,81.53 T3_ALT_THT.3 | 69.15,34.16 69.15,32.07 76.19,32.07 76.19,32.89 C10.2 | 47.24,57.15 47.24,57.9 arc90 R8B.1 46.93,58.8 46.93,58.23 53.47,58.23 57.4,58.23 | 47.24,57.15 47.24,53.15 46.61,52.51 46.61,51.07 R25.1 46.35,51.05 46.35,50.86 | R2A.2 29.59,60.39 29.59,63.18 28.07,64.71 28.07,64.9 | 28.07,64.9 v28.07,68.01 | v19.62,64.9 v20.77,64.9 28.07,64.9 | R2B.2 34.73,60.39 | 32.07,51.05 32.07,51.12 | 32.07,53.15 32.07,60.39 | 34.1,60.39 34.48,60.39 34.48,50.86 | 45.15,51.88 45.15,52.39 | 45.15,52.39 45.15,52.64 44.7,53.09 44.7,57.15 46.67,57.15 | 47.24,57.15 46.67,57.15 | 46.67,57.15 46.67,58.17 | 45.15,51.88 46.23,51.88 46.23,52.39 45.15,52.39 | U3.1 76.12,41.8 76.2,41.72 | C7.1 66.1,50.8 66.29,50.8 | 62.1,58.55 62.1,59.2 R8A.1 62.23,59.32 60.64,59.32 60.01,59.32 | 56.71,57.91 57.98,57.91 57.98,57.78 | 67.37,47.31 67.37,45.34 | T2_ALT_THT.3 v54.86,38.48 | v84.84,42.93 76.2,42.93 76.2,42.23 | 45.15,47.82 45.15,51.88 | 65.28,59.18 65.28,59.56 67.12,59.56 67.12,47.24 | 67.12,47.24 67.12,45.59 67.44,45.59 67.44,47.94 66.29,47.94
  Bottom 0.61: C6.2 66.93,47.05 67.12,47.24 | 66.29,58.99 66.29,59.56 62.74,59.56 | R22.1 T2.2 | 45.15,42.61 45.14,42.61 45.14,42.21 | DZ2.A 22.92,49.78 R29.2 21.84,44.64 22.23,44.64 | v55.56,64.52 55.56,66.29 57.4,68.14 57.4,75.44 C3A.2 55.63,75.42 55.75,75.42 | C16.2 36.2,65.72 v34.73,65.72 | 74.04,60.52 v74.11,60.52
  Bottom 0.813: 45.34,48.2 45.34,49.4 46.35,50.42 46.35,50.86 45.66,51.56 45.66,50.23 | 8.95,17.59 8.95,14.22 | 8.95,14.22 8.95,11.87 9.59,11.24 10.41,11.24 10.41,11.3 | T4.2 45.14,42.21 | K1.1 14.35,8.83 8.95,14.22 | 15.88,7.94 9.34,14.48 10.29,14.48 16.07,8.7 16.07,9.34 10.92,14.48 10.1,14.48 8.76,13.14 | 15.88,7.94 16.07,7.94 | 15.88,7.94 14.61,7.94 11.24,11.3 11.24,10.73 14.1,7.87 | 14.1,7.87 14.86,7.87 | 14.1,7.87 13.34,7.87 10.54,10.67 | C3B.2 49.02,77.79 DZ3B.A DZ3A.A 55.63,77.79 C3A.2 | GNDPIN.P$1 79.5,80.45 TLG.1 | v83.25,60.52 v74.11,60.52 | v60.01,60.39 60.01,59.32 U2.4
  Bottom 1.016: 29.59,60.39 32.07,60.39 34.1,60.39 R2B.2 | 34.73,60.39 v34.73,65.72 | 57.98,57.78 47.31,57.78 47.31,57.85 | T3.2 13.46,79.1 13.46,80.26 | 79.5,80.52 TLG.1 | 63.31,58.86 60.33,58.86 | 60.33,58.86 60.33,58.67 | 60.01,59.32 60.01,58.86 60.33,58.86 | 64.2,58.93 64.2,59.37 60.2,59.37 60.2,59.32 60.64,59.32 | JP1.2 JP5.4
  Bottom 1.27: 91.63,22.04 91.63,31.94 | 91.63,31.94 91.63,32.89 | 76.2,38.42 76.2,41.72 76.2,42.23 73.35,42.23 73.35,45.34 67.37,45.34 66.29,45.34 66.29,47.94 66.29,50.8 MOD1.P$19 66.29,58.99 66.29,59.2 R8A.1 | 76.19,38.42 C10.2 | R17.1 79.3,96.08 R18.1 80.96,94.81 80.96,84.58 | JP5.4 44.07,89.41 38.99,89.41 | 38.99,89.41 JP5.2 | TLG.1 79.5,84.58 80.96,84.58 | 76.19,32.89 91.63,32.89 | 32.07,51.05 37.08,51.05 37.08,47.82 45.15,47.82 T4_ALT_THT.3 45.15,43.52 | 53.47,58.23 v53.47,61.34 | 91.82,22.16 93.85,22.16 | 93.85,22.16 94.36,22.16 | 94.36,22.16 94.36,22.1 | 94.36,22.1 94.36,14.73 91.31,14.73 91.31,8.57 | 91.63,32.89 91.69,32.89 93.92,32.89 | 93.92,32.89 94.36,32.89 94.36,22.16 | 94.36,22.1 93.85,22.1 | 93.85,22.1 93.22,22.1 | 93.22,22.1 93.22,32.7 92.46,32.7 92.46,22.1 93.22,22.1 | 93.85,22.1 93.85,22.16 | 91.69,24.77 92.33,24.77 K5.SHIELD | 94.74,33.02 97.85,33.02 97.85,62.74 | 97.85,62.74 97.85,63.69 | 97.85,63.69 97.85,64.26 | 97.85,64.26 97.85,64.64 | 97.85,64.64 96.46,64.64 96.46,33.27 95.82,33.27 95.82,64.71 96.97,64.71 96.97,11.68 | 96.97,11.68 95.19,11.68 | 95.19,11.68 94.17,11.68 94.17,32.26 94.55,32.26 | 94.55,32.26 95.19,32.26 95.19,11.68 | 96.97,11.68 97.79,11.68 97.79,33.15 96.08,33.15 96.08,12.32 | 8.13,48.01 8.13,17.78 | 8.89,46.48 10.03,46.48 10.03,64.45 14.48,64.45 14.48,65.34 9.14,65.34 9.14,48.45 | 5.91,48.26 8.95,48.26 8.95,48.13 8.95,17.59 5.65,17.59 5.65,48.32 6.48,48.32 | 6.48,48.32 7.62,48.32 7.62,41.72 | 7.62,41.72 7.62,36.01 | 7.62,36.01 7.62,18.03 6.48,18.03 6.48,48.32 | 19.75,64.96 19.75,65.41 27.81,65.41 27.81,66.93 27.81,67.94 28,67.94 28,64.77 19.68,64.77 19.68,65.41
  Bottom 1.27: 93.92,32.89 94.55,32.26 | 91.63,31.94 75.63,31.94 75.63,33.47 | 32.07,51.12 32.07,53.15 | 13.72,84.45 13.72,64.83 13.46,64.83 13.46,64.96 | 13.46,64.96 13.46,80.26 13.46,84.64 13.46,85.34 | v13.4,64.9 13.46,64.96 | 7.05,40.96 7.05,36.01 7.62,36.01 | T2_ALT_THT.3 45.15,42.61 45.15,43.52 | 56.71,57.91 65.91,57.91 65.91,58.55 62.1,58.55 | R7A.1 96.84,63.69 97.85,63.69 | C15.C- 23.69,44.64 22.23,44.64 20.32,44.64 17.4,41.72 7.62,41.72 | T2.2 45.15,43.52 | 97.85,64.26 95.76,64.26 95.76,80.14 80.45,80.14 80.45,84.45 81.34,84.45 | 81.34,84.45 81.34,81.28 97.85,81.28 97.85,64.64 | 97.85,62.74 96.77,62.74 96.77,80.58 | 80.96,84.58 81.34,84.58 81.34,84.45 | DZ1.A 38.99,85.47 38.99,89.41
  Bottom 2.54: 8.26,12.19 8.26,18.99 6.29,18.99 6.29,11.3 10.41,11.3 10.6,11.3 8.76,13.14 7.75,14.16
  pour Bottom: 0,100.01 0,0 100.01,0 100.01,100.01
  pour Top: 0,100.01 0,0 100.01,0 100.01,100.01
IN_DELIC_A  (via drill 0.7)
  Bottom 0.61: 27.57,59.05 R2A.1 24.18,60.39 R1A.2 | 27.57,59.05 R3A.2 | v25.84,59.05 27.57,59.05
IN_DELIC_B  (via drill 0.7)
  Top 0.61: R1B.2 41.47,59.05 v43.18,59.05
  Bottom 0.61: v43.18,59.05 43.18,58.67 39.43,58.67 | 39.37,58.67 39.31,58.67 37.58,58.67 R2B.1 | 39.37,58.67 R3B.2 39.43,58.69 39.43,58.67 | 39.43,58.67 39.37,58.67
IOUT1+
  Bottom 0.61: 92.6,55.28 K2.3
  Bottom 0.813: 92.6,69.85 T1A.E 92.4,69.85 92.4,63.69 | C2A.1 92.4,63.69 | 92.4,63.69 92.4,61.4 | K2.3 92.4,60.39 92.4,61.4 | R6A.1 92.4,61.4
IOUT1-  (via drill 0.7)
  Top 0.61: K2.6 89.9,56.25 U1.2 80.52,56.25 v80.52,63.12 | v57.78,60.58 57.78,63.18 74.11,63.18 v74.11,63.12
  Bottom 0.61: R7A.2 89.65,64.45 | 89.65,55.28 K2.6 | U2.3 v57.78,60.59 v57.78,60.58 | v74.11,63.12 v80.52,63.12
  Bottom 0.813: C2A.2 89.9,63.69 | 89.9,63.69 89.9,61.4 | K2.6 89.9,60.45 89.9,61.4 | 89.9,63.69 89.9,64.45 R7A.2 | R6A.2 89.9,61.4
IOUT2+
  Bottom 0.61: 92.6,35.74 T1B.E | K2.5 92.6,48.48
  Bottom 0.813: C2B.1 92.4,40.13 | 92.4,40.13 92.4,40.96 92.4,42.55 | 92.6,35.74 92.4,35.74 92.4,40.13 | 92.4,42.55 K2.5 | R6B.1 92.4,42.55
IOUT2-  (via drill 0.7)
  Top 0.61: U1.6 74.11,57.53 v74.11,58.93 52.07,58.93 v52.07,59.44 | v80.33,53.47 v80.33,51.12
  Bottom 0.61: 89.65,39.37 R7B.2 | v74.11,58.93 80.33,58.93 v80.33,53.47 | v80.33,51.12 80.33,48.45 89.9,48.45 K2.8 89.65,48.48 | U2.5 52.07,59.31 v52.07,59.44
  Bottom 0.813: R6B.2 90.17,48.48 K2.8 | R7B.2 90.17,39.37 C2B.2 90.17,41.59 R6B.2 | R6B.2
JOY_BUT
  Top 0.61: MOD1.P$32 48.51,77.28 69.34,77.28 71.88,79.82 TLB.1
  Bottom 0.61: 71.88,87.57 71.88,87.5 | TLB.1 71.88,85.47 71.88,87.5 | K3.2 71.88,87.5
JOY_X  (via drill 0.7)
  Top 0.406: 74.68,89.79 74.68,88.2
  Top 0.61: 74.68,89.79 74.68,91.57 74.71,91.57 K3.8 74.71,97.41 v74.61,97.41 | 74.68,88.2 74.68,82.61 75.69,82.61 v75.69,75.44
  Bottom 0.61: R15.1 v74.61,97.41 R17.2 | R11.1 66.8,75.44 67.82,75.44 | 67.82,75.44 v75.69,75.44 76.96,75.44 R12.2 | MOD1.P$36 58.67,71.37 62.67,75.37 67.75,75.37 67.82,75.44
JOY_Y  (via drill 0.7)
  Top 0.61: v71.82,77.03 71.82,73.03 56.13,73.03 MOD1.P$35
  Bottom 0.406: 77.47,88.2 77.47,89.92
  Bottom 0.61: R16.1 R18.2 | 77.47,88.2 77.47,83.06 75.69,83.06 75.69,77.04 R14.2 R13.1 v71.82,77.04 v71.82,77.03 | 77.47,89.92 K3.9 77.42,91.81 R18.2 | 77.41,94.42 77.41,94.98 77.42,94.98 R18.2
LASER1-
  Bottom 0.61: JP4.2 R24.1
LASER1_DRAIN
  Bottom 1.016: T3.3 T3_ALT_THT.2 R24.2
LASER2-  (via drill 0.7)
  Top 0.406: 91.19,49.66 88.46,49.66
  Top 0.61: K2.2 92.11,50.58 91.19,49.66
  Top 1.016: 88.46,49.66 81.15,49.66 v81.15,44.9 | v75.12,44.9 v58.23,44.9 | v52.32,50.93 R26.1
  Bottom 0.61: v52.31,50.93 v52.32,50.93
  Bottom 1.016: v81.15,44.9 v75.12,44.9 | v58.23,44.9 52.31,44.9 v52.31,50.93
LASER2_DRAIN
  Top 0.813: R26.2 47.69,50.93
  Top 1.016: 47.69,50.93 T4_ALT_THT.2
  Bottom 1.016: T4_ALT_THT.2 T4.3
OPTO_ANODA
  Bottom 0.61: JP5.1 R19.2
OPTO_KOLEKTOR
  Top 0.61: JP5.3 41.53,79.38 43.75,79.38 | MOD1.P$30 43.75,70.36 43.75,79.38 | 43.75,79.38 R30.1
OUT_I1_FB  (via drill 0.7)
  Bottom 0.61: R10A.1 53.59,63.12 U2.1 57.53,63.12 57.53,64.39 62.23,64.39 R9A.1 62.23,64.45 v64.83,64.45
OUT_I2_FB  (via drill 0.7)
  Bottom 0.61: R10B.1 51.82,65.8 51.82,61.85 U2.7 47.56,61.85 47.05,62.36 45.85,62.36 R9B.1 v45.85,64.01
OUT_U1A  (via drill 0.7)
  Top 0.61: U1.1 v85.09,54.99 | v81.92,68.2 81.92,69.85 R4A.1
  Bottom 0.61: v85.09,54.99 85.09,61.98 81.92,61.98 81.92,67.56 v81.92,68.2
  Bottom 0.813: R5A.1 81.92,66.93 81.92,67.56
OUT_U1B  (via drill 0.7)
  Top 0.61: 79.25,56.26 79.26,56.26 v79.26,35.69 v79.25,35.69 | 79.25,65.42 79.25,56.26 | 79.25,56.26 U1.7
  Top 0.813: 79.25,65.42 79.25,65.29 R4B.1
  Bottom 0.61: v79.25,35.69 R5B.1
PIN_DIS_CLK
  Bottom 0.61: JP6.1 23.75,74.8 17.02,74.8 17.02,55.12 MOD1.P$1
PIN_DIS_DIO
  Bottom 0.61: JP6.2 26.29,73.53 18.29,73.53 18.29,57.59 22.99,57.59 23.11,57.47 MOD1.P$2
PIN_LASER_1  (via drill 0.7)
  Top 1.016: R23.2 18.67,88.2 T3_ALT_THT.1 18.67,81.22 v36.13,81.22
  Bottom 0.61: MOD1.P$29 40.89,81.22 v36.13,81.22
  Bottom 1.016: T3.1 18.67,79.1 T3_ALT_THT.1
PIN_LASER_2
  Bottom 0.61: MOD1.P$12 R25.2
  Bottom 0.813: R25.2 50.23,51.05 T4_ALT_THT.1 50.23,42.21 T4.1
PIN_RESET  (via drill 0.7)
  Top 0.813: v28.19,83.12 v38.8,83.12
  Bottom 0.813: MOD1.P$24 v28.19,83.12 | v38.8,83.12 51.69,83.12 JP1.1
PIN_SCL  (via drill 0.7)
  Top 0.61: 53.53,4.57 v59.37,4.57 53.59,4.57 MOD1.P$14
  Bottom 0.61: K4.P3 67.5,4.57 v59.37,4.57
PIN_SDA
  Top 0.61: MOD1.P$15 56.13,6.03 61.21,6.03 61.21,4.57 67.5,4.57 K4.P4
PIN_SERVO_ONOFF
  Top 0.61: MOD1.P$8 38.35,38.48 T2_ALT_THT.1
  Bottom 0.61: T2_ALT_THT.1 40.07,43.52 T2.1 41.66,45.72 R22.2
PIN_SERVO_SIG
  Bottom 0.61: JP3.1 30.73,36.64 MOD1.P$5
REF_U
  Bottom 0.61: DZ1.K 34.42,79.31 | 34.42,79.31 R27.1 | 34.42,79.31 35.81,79.31 MOD1.P$27
REZ_PA5
  Top 0.61: REZERVA7.1 MOD1.P$31
REZ_PA12
  Top 0.61: MOD1.P$9 REZERVA3.1
REZ_PA15
  Top 0.61: REZERVA4.1 MOD1.P$10
REZ_PB8
  Top 0.61: REZERVA5.1 MOD1.P$16
REZ_PB9
  Top 0.61: MOD1.P$17 REZERVA6.1
REZ_PB14
  Top 0.61: MOD1.P$3 REZERVA1.1
REZ_PB15
  Top 0.61: REZERVA2.1 MOD1.P$4
SCL2
  Top 0.406: DAC1.7 32.25,69.33 MOD1.P$26
  Bottom 0.61: MOD1.P$26 R21.1
SDA2
  Top 0.406: DAC1.8 31.6,69.49 MOD1.P$25
  Bottom 0.61: MOD1.P$25 R20.1
SERKOM_RX  (via drill 0.7)
  Top 0.61: MOD1.P$7 v35.81,8.13 35.81,8.51
  Bottom 0.61: U4.6 35.62,8.26 35.75,8.13 v35.81,8.13
SERKOM_TX  (via drill 0.7)
  Top 0.61: MOD1.P$6 v33.27,9.53
  Bottom 0.61: U4.7 v33.27,9.53
SERVO_GND  (via drill 0.7)
  Top 1.27: v29.4,33.21 24.7,33.21 JP3.3
  Bottom 1.016: JP3.3 24.7,33.4 C14.2
  Bottom 1.27: v29.4,33.21 42.61,33.21 T2_ALT_THT.2 T2.3
SERVO_PLUS  (via drill 0.7)
  Top 0.813: 19.37,10.92 K1.2 19.37,7.3 19.62,7.05 21.46,8.89 21.46,9.65 | 19.37,10.92 19.37,33.27 | 19.37,33.27 21.46,33.27 | 21.46,33.27 21.46,34.73 | 21.46,34.73 21.46,41.4 19.37,39.31 | 19.37,39.31 19.37,33.27 | 19.37,39.56 19.37,39.69 21.14,41.47 | 21.14,41.47 v21.14,38.29 21.02,38.29 | 21.02,38.29 21.02,33.97 19.88,33.97 19.88,39.12 20.51,39.75 20.51,38.8 | 20.51,38.8 20.51,33.08 | 20.51,33.08 19.75,32.32 19.75,31.37 21.4,33.02 21.4,41.4 21.21,41.4 19.37,39.56 | 19.37,39.56 19.37,39.31 | 20.51,38.8 21.02,38.29 | 21.46,9.72 21.46,33.27 | 21.46,34.73 19.88,33.15 19.88,8.7 | 21.53,38.86 21.53,39.43 26.67,39.43 26.67,36.58 27.69,36.58 27.69,41.47 21.21,41.47 | 21.21,41.47 21.21,40.89 27.24,40.89 27.24,37.02 27.11,37.02 27.11,40.13 21.59,40.13 | 21.14,41.47 21.21,41.47 | 19.37,10.92 19.94,10.35 19.94,7.94 20.7,8.7 20.7,9.59 | 20.51,33.08 20.51,32 20.64,31.88
  Top 1.016: 20.64,9.59 20.64,31.88 20.64,32.38
  Bottom 0.813: 28.83,42.42 28.83,39.18 28.13,38.48 | 28.13,38.48 27.56,37.91 27.56,36.64 JP3.2 27.24,39.94 22.29,39.94 19.05,36.7 18.99,36.7 | 28.13,38.48 28.13,44.32 | 18.99,36.7 SJ1-1.1 | SJ1-1.1 SJ1-2.1 | 27.43,37.85 26.73,38.54 | 26.73,38.54 26.73,44.58 C15.C+ 28.83,44.58 28.83,42.42 | 28.83,42.42 27.43,42.42 | 27.43,42.42 27.43,44.13 | 27.43,42.42 27.43,37.97 | 17.91,37.15 17.91,38.23 21.02,41.34 | 21.02,41.34 26.86,41.34 26.86,40.58 21.14,40.58 | 21.14,40.58 v19.81,39.24 | v19.81,39.24 18.16,37.59 | 21.91,40.45 18.41,36.96 18.16,36.96 17.97,37.15 17.91,37.15 | 17.91,37.15 17.91,36.77 17.84,36.7 SJ1-1.1 | 17.91,37.15 20.51,39.75 | 21.02,40.26 21.46,40.7 21.46,40.77 20.51,39.81 20.51,39.75 | 19.88,36.64 19.05,36.64 18.99,36.7 | 19.88,36.64 22.86,39.62 22.86,39.18 | 22.86,39.18 20.32,36.64 19.88,36.64 | 24.32,40.39 24.07,40.39 22.86,39.18 | 19.88,36.83 19.81,36.89 v19.81,37.34 19.88,37.27 19.88,36.64 | v19.81,39.24 20.77,38.29 v21.14,38.29 21.14,38.73 20.51,39.37 20.51,39.75 | v21.14,40.13 21.14,40.58 | 21.02,41.34 21.02,40.26 | 21.02,40.26 20.51,39.75 | 27.11,36.07 26.73,36.45 26.73,38.54
  Bottom 1.016: JP3.2 27.24,33.4 C14.1
STAB_12V  (via drill 0.7)
  Top 0.61: 77.66,32.51 77.66,32.58 77.79,32.58 | v49.02,65.85 v72.83,65.85 | v72.83,54.99 U1.8 77.66,54.99
  Top 0.813: 77.66,54.99 77.66,32.58 | T1B.C 90.36,32.51 77.66,32.51 68.64,32.51 v68.64,26.48 | v31.37,26.48 31.37,48.26 DCDC_OUT+.P$1
  Bottom 0.61: C12.1 13.42,44.58 | U2.8 49.02,63.12 v49.02,65.85 | R28.1 12.13,52.01 C13.1
  Bottom 0.813: C13.1 12.13,48.26 DCDC_OUT+.P$1 13.42,48.26 C12.1 | v72.83,54.99 v72.83,65.85 72.83,72.45 90.3,72.45 T1A.C | v68.64,26.48 v31.37,26.48
TEST_12V  (via drill 0.7)
  Top 0.61: MOD1.P$28 38.35,73.53 v15.81,73.53
  Bottom 0.61: R28.2 18.8,52.01 DZ2.K | DZ2.K 18.8,49.78 R29.1 | DZ2.K 15.81,52.07 v15.81,73.53 | MOD1.P$28 38.1,70.36 C16.1
U1A_NEINVERT  (via drill 0.7)
  Top 0.61: U1.3 v86.55,57.52 v86.55,57.53 | v73.53,52.45 71.12,52.45 71.12,57.47 v30.86,57.47 23.5,57.47 23.5,65.98 C1A.1
  Bottom 0.61: v30.86,57.47 29.46,57.47 29.46,58.04 29.45,58.04 R3A.1 | v86.55,57.53 86.55,52.39 73.53,52.39 v73.53,52.45
U1B_NEINVERT  (via drill 0.7)
  Top 0.61: U1.5 75.44,58.8 75.44,67.5 41.62,67.5 C1B.1 42.16,65.98 | v43.69,67.5 42.16,67.5 42.16,65.98 | 42.16,65.85 42.16,65.98
  Bottom 0.61: R3B.1 39.37,67.5 v43.69,67.5
U2A_INVERT  (via drill 0.7)
  Bottom 0.61: U2.2 62.36,61.86 | 62.36,61.86 62.61,61.86 62.61,62.23 | R9A.2 62.61,62.56 62.61,62.23 | R8A.2 62.36,61.07 62.36,61.86 | 62.61,62.23 62.48,62.23 62.48,61.91 v64.83,61.91
U2B_INVERT  (via drill 0.7)
  Bottom 0.61: U2.6 45.85,60.58 R9B.2 | R9B.2 45.03,60.53 R8B.2 | v43.56,61.02 43.56,60.53 R9B.2
USB_5V  (via drill 0.7)
  Top 0.305: 15.11,17.65 14.99,17.65 DCDC_IN+.P$1
  Top 1.016: v89.34,29.97 94.23,29.97 94.23,42.61 92.46,44.39 92.46,46.1 94.23,47.88 94.23,53.18 K2.1
  Top 1.27: v15.37,29.46 10.86,29.46
  Top 1.93: 15.11,17.65 11.24,17.65 11.24,29.84 v11.24,74.49 11.24,76.2
  Top 2.184: v15.37,29.46 11.24,29.46 11.24,29.84
  Bottom 0.305: JP4.1 18.67,91.38
  Bottom 0.61: 85.64,22.08 D3.A | 64.26,41.8 U3.3 68.56,41.8 68.52,41.85 | 64.26,41.8 63.75,41.8 63.73,41.8 C8.1 63.73,34.16 | 28.7,95.06 28.83,95.06 | JP6.3 28.83,95.06 | 28.83,95.06 33.53,95.06 33.85,95.06 33.85,87.9 34.04,87.71 R19.1 | 88.96,29.91 89.41,29.91 v89.34,29.97 C4.1 89.34,25.15 88.96,25.15 | 63.73,34.16 65.15,34.16 C9.1 | 63.73,34.16 63.44,34.16 63.44,29.91 | 27.56,30.04 27.88,30.04 | 27.05,30.04 27.56,30.04 | 27.56,30.04 27.56,29.91 | L1.1 63.97,42.1 64.26,41.8
  Bottom 0.813: 27.05,30.04 27.94,30.04 | 15.49,29.46 v15.37,29.46 | 15.49,38.04 15.98,38.04 SJ1-2.2 SJ1-1.2 | 89.03,22.1 88.96,22.1 88.01,22.1 88.01,28.45 87.44,28.45 | 87.44,22.42 87.44,28.45 | 87.44,28.45 14.73,28.45 14.73,30.86 64.2,30.86 64.2,31.37 14.67,31.37 | 14.67,31.37 14.67,38.61 16.07,38.61 | 14.67,31.37 14.67,30.23
  Bottom 1.27: 88.96,22.08 85.64,22.08 | K5.VBUS 88.96,22.08 | 88.96,22.08 88.96,22.1 88.96,25.15 88.96,29.08 | 88.96,29.08 88.96,29.91 63.44,29.91 27.56,29.91 14.99,29.91 DCDC_IN+.P$1 | 66.04,34.04 66.04,30.73 65.91,30.73 65.91,33.34 63.82,33.34 | 63.82,33.34 63.82,33.27 | 63.82,33.27 63.82,31.43 | 64.07,34.54 66.17,34.54 66.17,34.16 65.15,34.16 | 63.75,41.8 63.75,33.34 63.82,33.34 | 11.37,95.06 28.7,95.06 | 28.89,95.06 33.53,95.06 | 28.89,92.08 28.89,95.06 | 28.7,91.95 28.7,95.06 | 28.7,95.06 28.89,95.06 | 63.82,33.27 64.9,33.27 64.9,30.42 64.14,30.42 64.14,32.13 | 64.14,41.85 68.52,41.85 | 15.37,17.34 15.37,29.08 88.96,29.08
  Bottom 1.93: 18.67,92.08 JP4.1 18.67,95.38 11.24,95.38 11.24,95.06 | 11.24,95.06 v11.24,75.95 v11.24,74.49 | 11.24,95.06 11.37,95.06 | 15.49,38.04 15.49,29.46
USB_5V_STM
  Bottom 0.61: MOD1.P$18 63.75,50.67 | C7.2 63.75,50.67 | 63.75,50.67 63.75,50.55
  Bottom 1.27: MOD1.P$18 63.75,50.55 63.56,50.55 60.52,47.5 60.52,47.47 C6.1 60.94,42.1 L1.2
USB_D+
  Bottom 0.61: U4.1 89.05,15.64 91.57,18.16 91.57,19.45 K5.D+
USB_D-
  Bottom 0.61: U4.2 87.38,9.53 87.38,17.24 K5.D-
VCC-CH340
  Bottom 0.61: U4.5 85.41,6.99 85.41,18.61 81.24,18.61 D3.C
(copper drawn outside any net)
  shapes: Bottom circle x5, Top circle x5

### Text on the board
tPlace: LASER | DISPL. | OPTO | RST | C | D | V | G | A | G | K | G | G | R | V | X+ | Y+ | B | Y- | X- | G | S | D | G | JOY / (alt) | GND | B | C | E | S | D | G | G | D | S | G | S | V | B | C | E | SERVO | Svetelny kalibrator / pro SQM | ver. 2b | G | V
bPlace: 6. | 9. | 1 | 5 | 3V3 | SCL | https://sqm.astromik.org | GND | SDA
tDocu: GND | +9V / (OUT) | GND | +5V / (IN)
test: GND | 4A | 3B | 6A | 6B | 1A | 1B | 5B | 5A | 2A | 3A | 2B | 4B